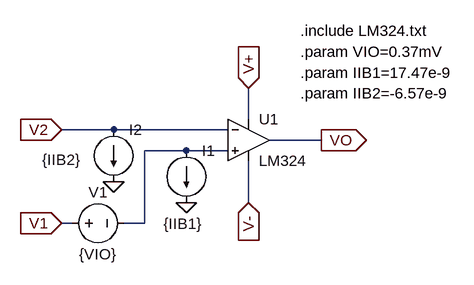
[diagram p0: schematic opamp2Offset.asc]
opamp2Offset.asc, the LTspice schematic file:
Version 4
SHEET 1 880 680
WIRE 208 128 208 80
WIRE 0 144 -80 144
WIRE 176 144 0 144
WIRE 320 160 240 160
WIRE 112 176 48 176
WIRE 176 176 112 176
WIRE 208 256 208 192
WIRE -64 288 -80 288
WIRE 48 288 48 176
WIRE 48 288 16 288
FLAG 0 224 0
FLAG 112 256 0
FLAG -80 288 V1
IOPIN -80 288 In
FLAG -80 144 V2
IOPIN -80 144 In
FLAG 208 80 V+
IOPIN 208 80 In
FLAG 208 256 V-
IOPIN 208 256 In
FLAG 320 160 VO
IOPIN 320 160 Out
SYMBOL OpAmps\\opamp2 208 96 R0
SYMATTR InstName U1
SYMATTR Value LM324
SYMBOL current 112 176 R0
WINDOW 3 -35 113 Left 2
WINDOW 123 0 0 Left 0
WINDOW 39 0 0 Left 0
SYMATTR Value {IIB1}
SYMATTR InstName I1
SYMBOL current 0 144 R0
WINDOW 3 -110 46 Left 2
WINDOW 123 0 0 Left 0
WINDOW 39 0 0 Left 0
SYMATTR Value {IIB2}
SYMATTR InstName I2
SYMBOL voltage -80 288 R270
WINDOW 0 32 56 VTop 2
WINDOW 3 -32 56 VBottom 2
WINDOW 123 0 0 Left 0
WINDOW 39 0 0 Left 0
SYMATTR InstName V1
SYMATTR Value {VIO}
TEXT 288 24 Left 2 !.param VIO=0.37mV
TEXT 288 56 Left 2 !.param IIB1=17.47e-9
TEXT 288 88 Left 2 !.param IIB2=-6.57e-9
TEXT 288 -8 Left 2 !.include LM324.txt

The netlist it stands for:
* opamp2Offset.asc
XU1 N001 V2 V+ V- VO LM324  ; pins In+ In- V+ V- OUT
I1 N001 0 {IIB1}
I2 V2 0 {IIB2}
V1 V1 N001 {VIO}
.param VIO=0.37mV
.param IIB1=17.47e-9
.param IIB2=-6.57e-9
.include LM324.txt
.backanno
.end